# EasyEDA Pro project 赛博福徽章.epro

# Board PCB3_4
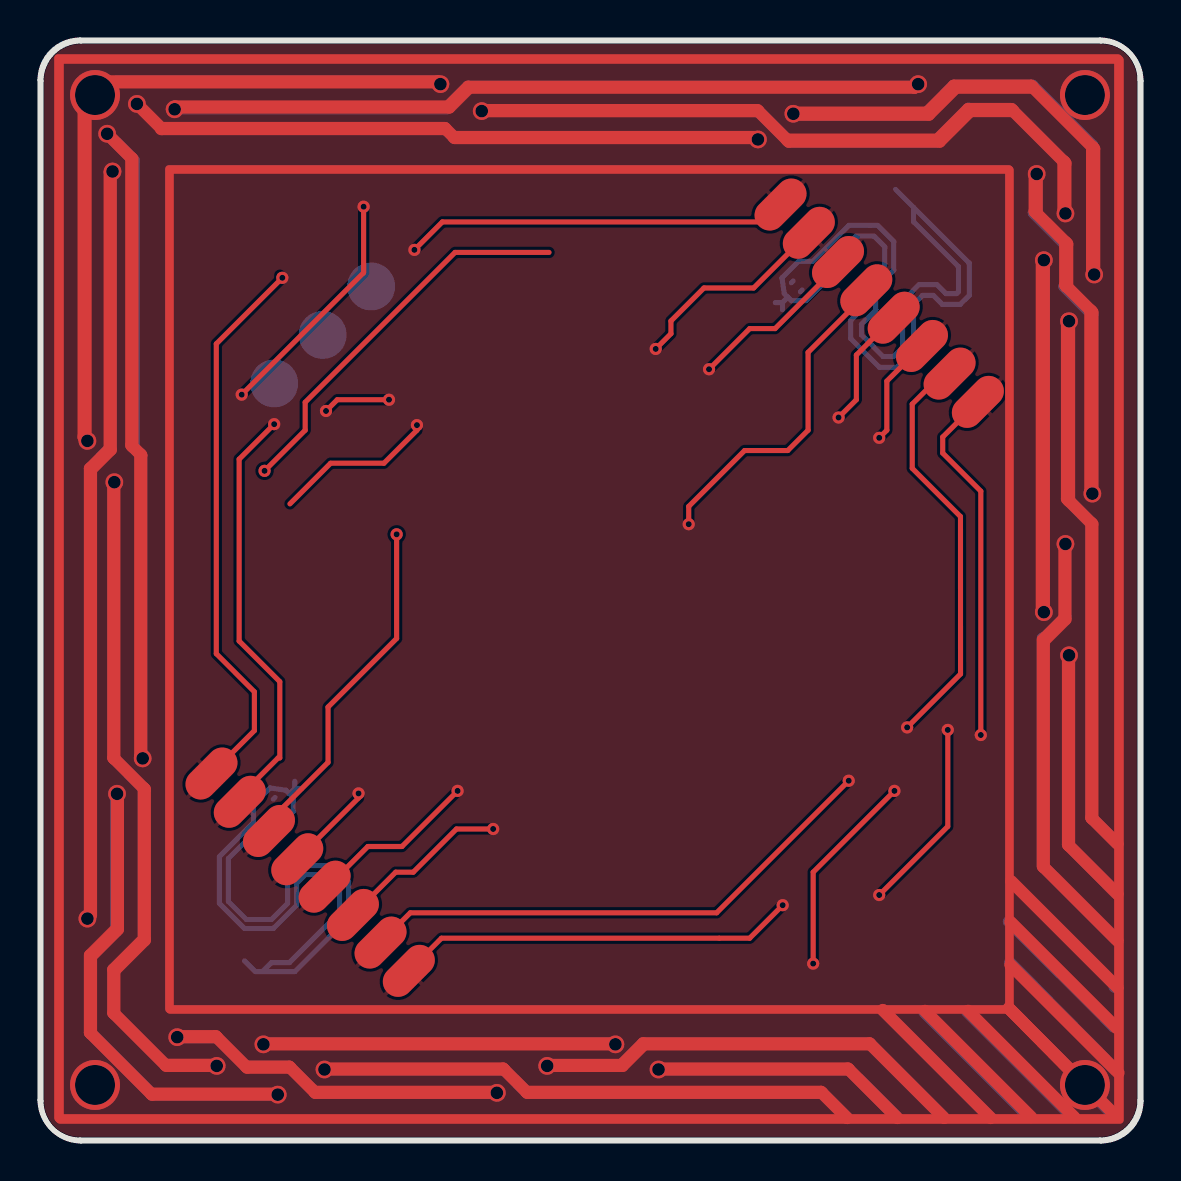
[diagram p0: board, top side]
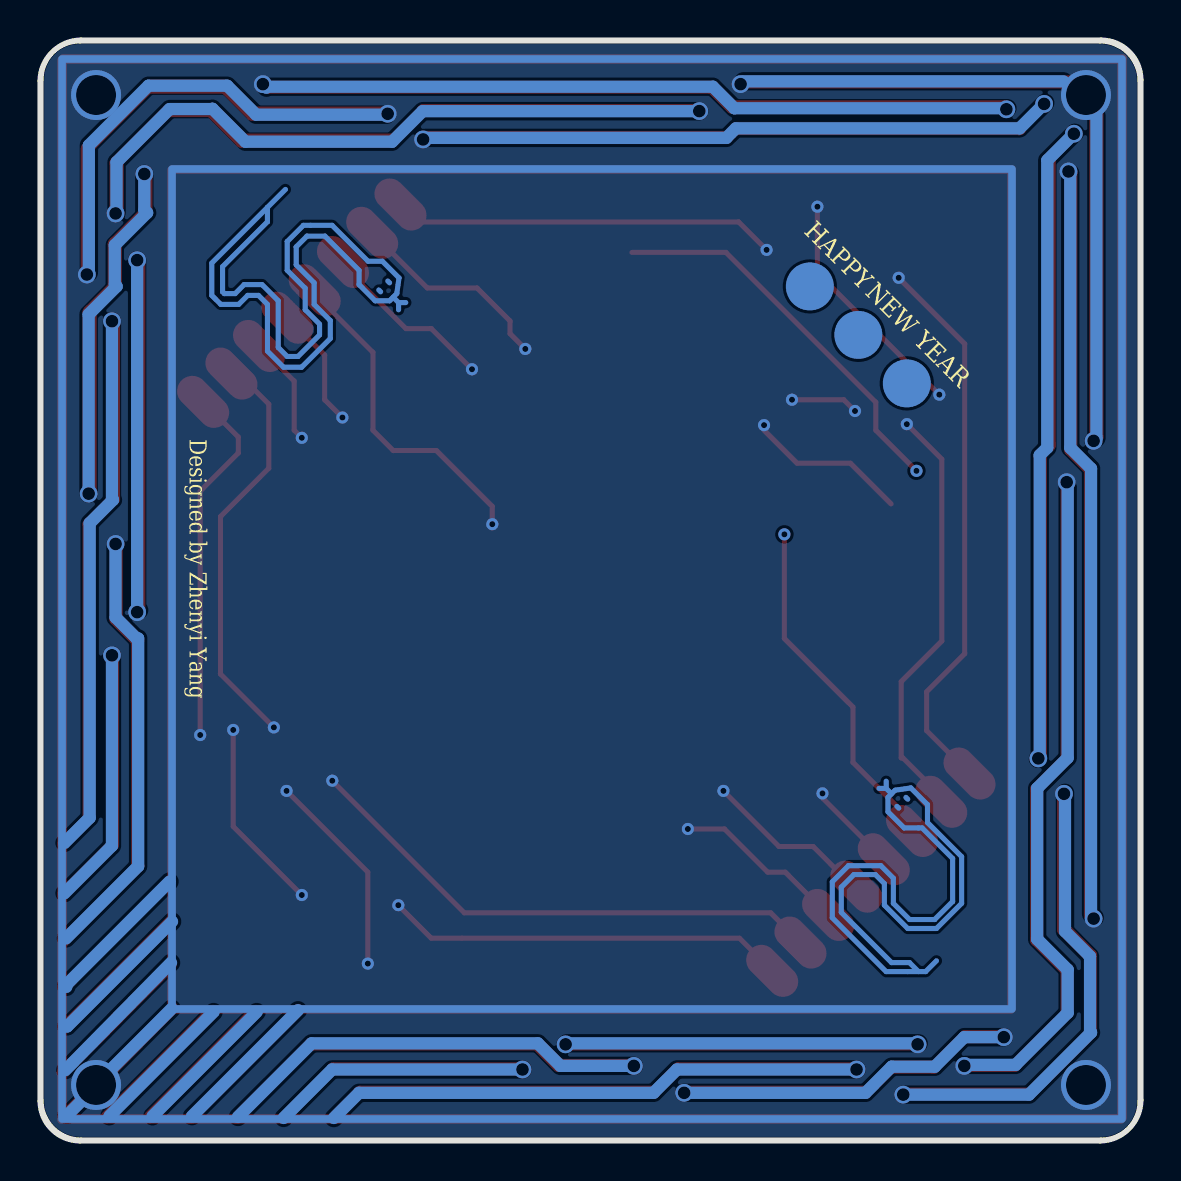
[diagram p1: board, bottom side, seen from below]

Outline 55.05 x 55.05 mm; copper layers: Top Layer, Bottom Layer. Coordinates in mm from the lower left corner of the outline.
Outline path: 0,53.05 arc(0.59,54.46) 2,55.05 53,55.05 arc(54.41,54.46) 55,53.05 55,2.05 arc(54.41,0.64) 53,0.05 2,0.05 arc(0.59,0.64) 0,2.05 0,53.05 ; 0.05,53 arc(0.64,54.42) 2.05,55 53.05,55 arc(54.47,54.42) 55.05,53 55.05,2 arc(54.47,0.59) 53.05,0 2.05,0 arc(0.64,0.59) 0.05,2 0.05,53
Stack: Top Layer 0.035mm / Dielectric1 1.51mm FR4 er 4.5 / Bottom Layer 0.035mm

## Design rules (mm)
template: JLCPCB Capability(Two Layers Board)
spacing copperThickness1oz (default): track to track 0.102, other pairs 0.152 to 0.3
spacing copperThickness2oz: track to track 0.203, other pairs 0.152 to 0.3
track width copperThickness1oz (default): min 0.127, default 0.254, max 2.54
track width copperThickness2oz: min 0.203, default 0.254, max 2.54
differential pair differentialPair (default): width min 0.127, default 0.254, max 2.54; gap min 0.152, default 0.152
via viaSize (default): diameter min 0.5, default 0.61, max 10; hole min 0.3, default 0.305, max 6.3

## Placement (name value [footprint] x y rotation side)
F2  -  [福字]  24.82 45.95 45 top
HAPPY  -  [单点焊盘]  16.56 42.73 225 bottom
NEW  -  [单点焊盘]  14.13 40.31 225 bottom
S2  -  [小蛇标志2]  12.29 12.51 45 top
S3  -  [蛇年标志]  48.95 27.54 225 bottom
SNA2  -  [小蛇]  42.33 43.18 225 bottom
U11  -  [金手指8P]  13.51 13.44 315 top
U11#2  -  [金手指8P]  41.97 41.88 315 top
YEAR  -  [单点焊盘]  11.71 37.88 225 bottom

## Footprints (pads in the part's own frame, mm; a bottom-side part is the same pattern mirrored in y, then rotated)
金手指8P
  oval 1.524x3.048 smd: 1(-6.985,0) 2(-4.985,0) 3(-2.921,0) 4(-0.921,0) 5(1.016,0) 6(3.016,0) 7(4.969,0) 8(6.969,0)

## Nets
GND: U11.1 U11.2 U11.3 U11.4 U11.5 U11.6 U11.7 U11.8 U11#2.1 U11#2.2 U11#2.3 U11#2.4 U11#2.5 U11#2.6 U11#2.7 U11#2.8

## Via types
v1: diameter 0.61, hole 0.305, Top Layer to Bottom Layer, 26 vias
v2: diameter 2.5, hole 2, Top Layer to Bottom Layer, 4 vias
v3: diameter 0.889, hole 0.635, Top Layer to Bottom Layer, 32 vias

## Routing (per net, layer and track width the routed paths; a pad name or vN(x,y) marks a point on that pad's centre or on a via; arc(x,y) is an arc through that point)
GND: length 1064.2
  Top Layer w0.61: 51.26,44.95 51.31,44.9 ; 51.26,44.95 51.26,42.8 51.31,42.75 ; 51.26,44.95 49.84,46.38 ; 51.31,44.9 51.31,42.75 ; 51.31,44.9 51.36,44.85 51.36,42.7 ; v3(51.45,40.99) 51.45,32.01 ; 51.45,32.01 51.4,32.06 ; 51.45,32.01 52.57,30.89 ; 48.52,10.96 53.83,5.65 ; 3.67,32.99 3.67,19.16 3.72,19.11 ; 52.62,16.11 52.57,16.16 52.57,30.89 ; 52.62,16.11 53.88,14.86 ; 52.62,16.11 52.62,30.84 52.57,30.89 ; 12.52,3.67 12.47,3.72 10.31,3.72 ; 12.52,3.67 10.36,3.67 10.31,3.72 ; 12.52,3.67 13.72,2.46 ; 52.2,2.96 52.2,2.85 v2(52.25,2.8) ; 52.2,2.96 52.19,2.96 ; 52.2,2.96 52.25,2.91 v2(52.25,2.8) ; 37.34,50.07 37.39,50.02 ; 37.34,50.07 35.92,51.5 ; 37.34,50.07 44.89,50.07 46.41,51.6 48.57,51.6 48.62,51.55 ; 37.39,50.02 37.44,49.97 44.99,49.97 46.51,51.5 48.67,51.5 ; 37.39,50.02 44.94,50.02 46.46,51.55 48.62,51.55 ; 3.58,48.53 3.49,48.44 3.49,34.61 2.5,33.62 2.5,11.35 2.32,11.17 ; v3(25.36,3.76) 29.13,3.76 30.21,4.83 41.52,4.83 ; v3(50.19,26.44) v3(50.19,44.04) ; 4.56,49.16 4.56,34.79 4.61,34.74 ; 4.56,49.16 3.31,50.41 ; 4.56,49.16 4.61,49.11 4.61,34.74 ; 25.31,3.81 29.08,3.81 30.16,4.88 41.47,4.88 41.52,4.83 ; 51.31,42.75 51.36,42.7 ; v3(3.72,32.94) 3.72,19.11 ; 3.72,19.11 5.19,17.64 ; 51.45,14.77 v3(51.45,24.29) ; 51.45,14.77 53.88,12.34 ; 51.45,14.77 51.4,14.82 51.4,24.34 ; 23.2,3.58 23.15,3.63 14.17,3.63 ; 23.2,3.58 v3(14.22,3.58) ; 23.2,3.58 24.32,2.46 ; 51.17,48.99 51.17,46.48 ; 51.17,48.99 51.22,48.94 ; 51.17,48.99 48.67,51.5 ; 6.1,50.6 6.05,50.65 ; 6.1,50.6 6.05,50.6 ; 6.1,50.6 20.29,50.6 ; 6.05,50.65 20.24,50.65 20.29,50.6 ; 6.05,50.65 4.79,51.91 ; 52.14,3.01 52.19,2.96 ; 52.14,3.01 52.07,3.01 ; 52.14,3.01 52.18,3.01 ; 52.19,2.96 52.12,2.96 ; 52.19,2.96 52.23,2.96 ; 2.18,52.87 2.18,35.2 2.23,35.15 ; 51.22,48.94 51.27,48.89 v3(51.27,46.38) ; 51.22,48.94 51.22,46.43 ; v3(11.89,2.32) 5.6,2.32 5.55,2.37 ; 6.27,3.81 6.32,3.76 v3(8.84,3.76) ; 6.27,3.81 3.72,6.36 ; 6.27,3.81 8.78,3.81 ; 49.78,48.4 49.78,46.43 ; 49.78,46.43 49.73,46.48 49.73,48.45 ; 49.78,46.43 49.84,46.38 ; 24.32,2.46 39.05,2.46 39.1,2.41 ; 24.32,2.46 24.37,2.41 39.1,2.41 ; 2.23,35.15 2.28,35.1 ; 2.23,35.15 2.23,52.82 ; 2.28,35.1 2.28,52.77 ; 2.28,35.1 v3(2.37,35.01) ; 35.83,50.15 20.74,50.15 20.69,50.2 ; 35.83,50.15 v3(35.9,50.08) ; 35.83,50.15 35.78,50.2 20.69,50.2 ; 48.52,6.57 52.07,3.01 ; 48.52,6.57 52.01,3.01 ; 48.52,6.57 48.47,6.62 ; 52.07,3.01 52.01,3.01 ; 52.07,3.01 52.12,2.96 ; 46.41,6.51 51.72,1.2 ; v3(3.85,17.36) 3.9,17.32 3.9,10.58 2.55,9.23 2.55,5.37 ; 52.52,41.54 52.52,32.47 ; 52.52,41.54 52.57,41.49 ; 52.52,41.54 51.36,42.7 ; 35.92,51.5 35.87,51.55 22.04,51.55 ; 35.92,51.5 v3(22.09,51.5) ; 2.21,52.98 19.88,52.98 19.93,52.93 ; v3(22.84,2.41) 13.77,2.41 13.72,2.46 ; v3(5.13,19.13) 5.06,19.2 ; 5.06,19.2 5.01,19.25 5.01,34.34 ; 5.06,19.2 5.06,34.29 5.01,34.34 ; 52.57,41.49 52.57,32.42 ; 52.57,41.49 52.62,41.44 v3(52.62,32.37) ; 52.12,2.96 52.06,2.96 52.01,3.01 ; 49.66,52.66 52.61,49.71 ; 49.66,52.66 45.79,52.66 44.45,51.32 37.71,51.32 v3(37.67,51.36) ; 49.66,52.66 49.61,52.71 ; 52.61,49.71 52.61,43.43 ; 52.61,49.71 52.66,49.66 ; v2(52.25,2.8) 53.74,1.31 ; 3.72,6.36 3.72,8.52 5.24,10.04 5.24,17.59 5.19,17.64 ; 3.72,6.36 3.67,6.41 3.67,8.57 5.19,10.09 5.19,17.64 ; 40.45,3.58 42.87,1.15 ; 40.45,3.58 v3(30.93,3.58) ; 40.45,3.58 40.39,3.63 30.88,3.63 ; 28.72,4.88 11.12,4.88 ; 50.19,13.69 50.19,25 51.27,26.08 v3(51.27,29.85) ; 50.19,13.69 53.88,10.01 ; 50.19,13.69 50.14,13.74 50.14,25.06 51.22,26.13 51.22,29.9 ; 4.61,34.74 5.01,34.34 ; 48.67,51.5 48.62,51.55 ; 37.62,51.41 37.66,51.37 44.4,51.37 45.74,52.71 49.61,52.71 ; 19.93,52.93 v3(20.02,52.84) ; 19.93,52.93 2.26,52.93 ; 5.55,2.37 2.55,5.37 ; 5.55,2.37 11.84,2.37 ; 6.68,51.64 6.77,51.73 20.42,51.73 21.41,52.71 43.68,52.71 43.86,52.89 ; 20.69,50.2 20.29,50.6 ; 51.4,32.06 51.35,32.11 51.35,41.09 ; 51.4,32.06 51.4,41.04 ; 49.61,52.71 49.56,52.76 45.69,52.76 44.35,51.42 37.61,51.42 37.57,51.46 ; 2.55,5.37 2.5,5.42 2.5,9.28 3.85,10.63 3.85,17.37 3.8,17.41 ; 50.09,26.54 50.09,44.14 ; 6.81,5.24 8.78,5.24 8.84,5.19 ; 49.84,46.38 v3(49.84,48.35) ; 10.31,3.72 8.84,5.19 ; 13.72,2.46 22.79,2.46 ; 52.01,3.01 48.47,6.62 ; 41.52,4.83 45.21,1.15 ; 52.66,49.66 52.66,43.37 ; 52.66,49.66 52.71,49.61 v3(52.71,43.32) ; 48.47,6.62 48.44,6.65 ; v3(6.73,51.59) 6.82,51.68 20.47,51.68 21.46,52.66 43.73,52.66 v3(43.91,52.84) ; v3(3.63,48.48) 3.54,48.39 3.54,34.56 2.55,33.57 2.55,11.3 v3(2.37,11.12) ; 39.1,2.41 40.36,1.15 ; 48.52,8.81 53.92,3.4 ; 42.14,6.55 47.54,1.15 ; 48.57,12.98 53.88,7.67 ; v3(28.77,4.83) v3(11.17,4.83) ; v3(6.86,5.19) 8.84,5.19 ; 50.14,26.49 50.14,44.09 ; 44.25,6.51 49.56,1.2
  vias: v1(10.08,37.32) v1(11.71,35.84) v1(12.12,43.16) v1(14.3,36.5) v1(15.93,17.38) v1(16.18,46.72) v1(17.45,37.06) v1(18.72,44.56) v1(18.85,35.79) v1(20.88,17.51) v1(22.66,15.6) v1(30.79,39.6) v1(32.44,30.84) v1(33.45,38.59) v1(37.14,11.79) v1(38.66,8.87) v1(39.93,36.18) v1(40.44,18.01) v1(41.96,35.16) v1(41.96,12.3) v1(42.72,17.51) v1(43.36,20.68) v1(45.39,20.55) v1(47.04,20.3) v2(2.75,52.3) v2(2.75,2.8) v2(52.25,52.3) v3(3.36,50.36) v3(4.84,51.86)
(no net): length 22.2
  Bottom Layer w0.61: 46.37,6.45 51.58,1.24 ; 42.15,6.54 47.45,1.24 ; 44.22,6.45 49.43,1.24
  vias: v1(11.23,33.51) v1(17.83,30.33)

## Copper pours and planes (outline as drawn; the poured copper is in the pictures)
GND on Top Layer: -48.32,26.52 24.42,99.26 95.19,28.5 22.45,-44.24
GND on Bottom Layer: -49.36,27.1 28.05,104.51 103.67,28.9 26.26,-48.51

## Text on the board
Bottom Solder Mask Layer: 新年快乐
Bottom Silkscreen Layer: Designed by Zhenyi Yang
